# Altium schematic sheet LiPol_module.SchDoc
size A4
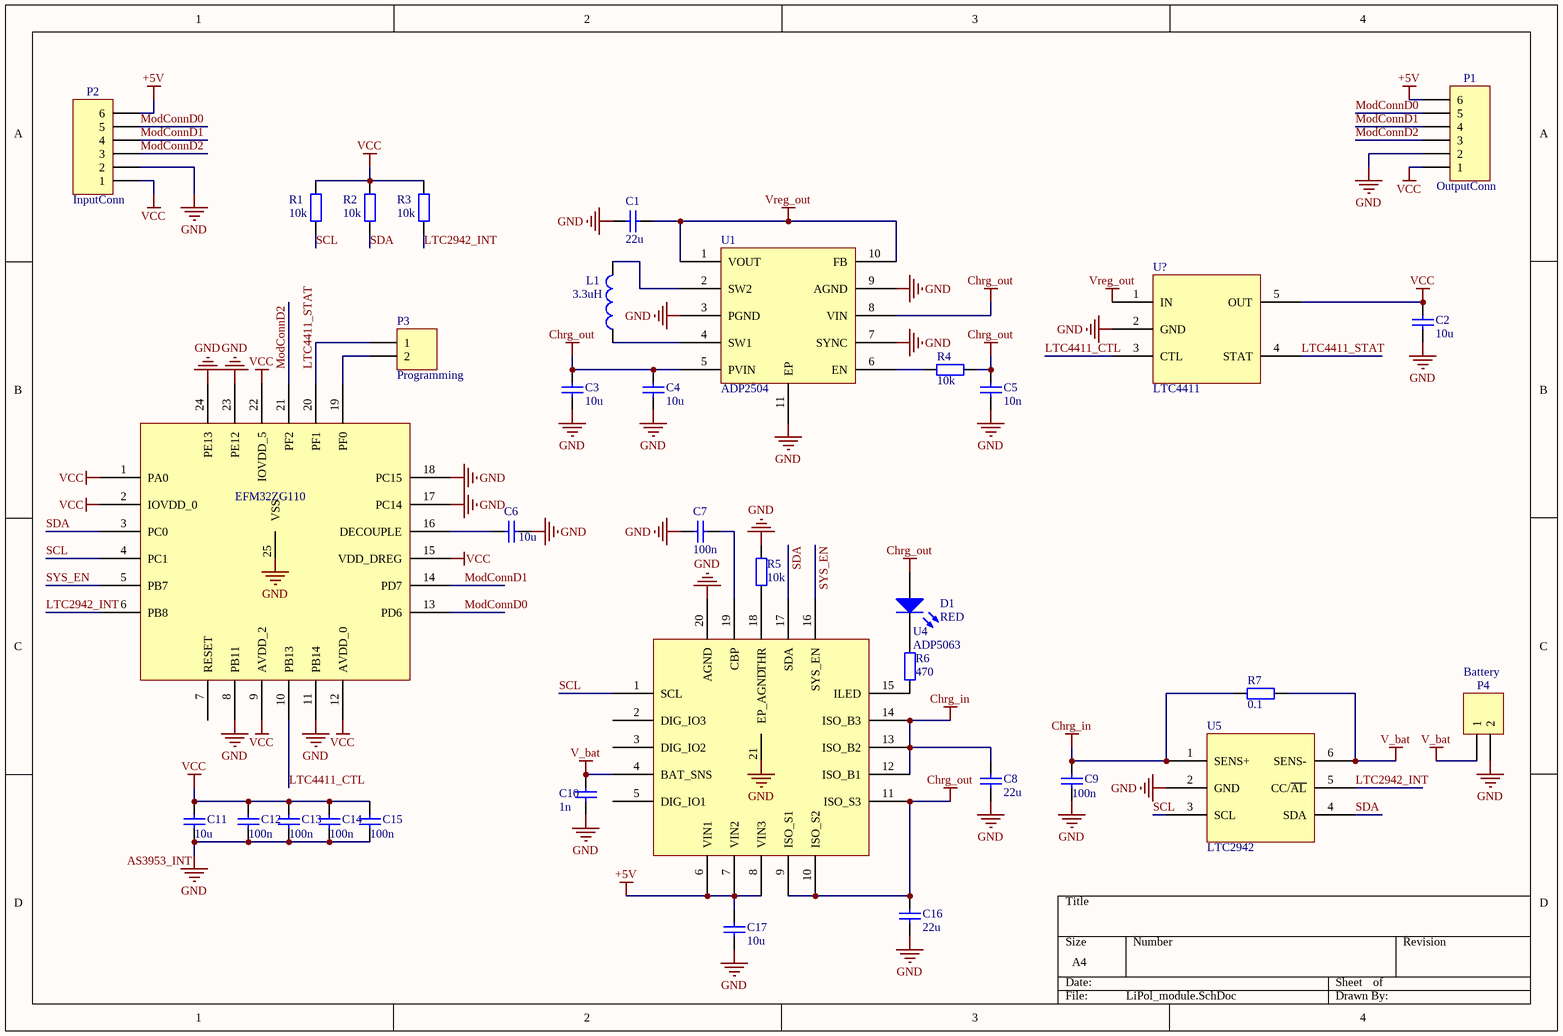
[diagram p0: LiPol_module.SchDoc]

## Parts
C1  value 22u  [C1206]  (hidden comment: 10u)
C2  10u  [0805]
C3  10u  [0805]
C4  10u  [0805]
C5  value 10n  [0402]  (hidden comment: Cap Semi)
C6  10u  [0805]
C7  value 100n  [0402]  (hidden comment: Cap Semi)
C8  value 22u  [C1206]  (hidden comment: 10u)
C9  value 100n  [0402]  (hidden comment: Cap Semi)
C10  value 1n  [0402]  (hidden comment: Cap Semi)
C11  10u  [0805]
C12  value 100n  [0402]  (hidden comment: Cap Semi)
C13  value 100n  [0402]  (hidden comment: Cap Semi)
C14  value 100n  [0402]  (hidden comment: Cap Semi)
C15  value 100n  [0402]  (hidden comment: Cap Semi)
C16  value 22u  [C1206]  (hidden comment: 10u)
C17  10u  [0805]
D1  RED  [0603]
L1  value 3.3uH  [Coil_EPL2010]  (hidden comment: EPL2010-332ML)
P1  OutputConn  [Goldpin6_1.27mm]
P2  InputConn  [Goldpin6_1.27mm]
P3  Programming  [GeckoProgramming]
P4  Battery  [Battery_Connector]
R1  value 10k  [0402]  (hidden comment: Res2)
R2  value 10k  [0402]  (hidden comment: Res2)
R3  value 10k  [0402]  (hidden comment: Res2)
R4  value 10k  [0402]  (hidden comment: Res2)
R5  value 10k  [0402]  (hidden comment: Res2)
R6  value 470  [0402]  (hidden comment: Res2)
R7  value 0.1  [0805]  (hidden comment: Res2)
U1  ADP2504  [DFN10_3x3x0.5]
U3  EFM32ZG110  [QFN24_5x5_0.65]
U4  ADP5063  [QFN20_4x4x0.5]
U5  LTC2942  [DCB 6-Lead 2x3mm]
U?  LTC4411  [SOT23-5]

## Nets
+5V: C17.2 P1.6 P2.6 U4.6(VIN1) U4.7(VIN2) U4.8(VIN3)
Chrg_in: C8.2 C9.2 R7.2 U4.12(ISO_B1) U4.13(ISO_B2) U4.14(ISO_B3) U5.1(SENS+)
Chrg_out: C3.2 C4.2 C5.2 C16.2 D1.1(A) R4.2 U1.5(PVIN) U1.8(VIN) U4.9(ISO_S1) U4.10(ISO_S2) U4.11(ISO_S3)
GND: C1.1 C2.2 C3.1 C4.1 C5.1 C6.1 C7.1 C8.1 C9.1 C10.1 C11.1 C12.1 C13.1 C14.1 C15.1 C16.1 C17.1 P1.2 P2.2 P4.2 R5.1 U1.3(PGND) U1.7(SYNC) U1.9(AGND) U1.11(EP) U3.8(PB11) U3.11(PB14) U3.17(PC14) U3.18(PC15) U3.23(PE12) U3.24(PE13) U3.25(VSS) U4.20(AGND) U4.21(EP_AGND) U5.2(GND) U?.2(GND)
V_bat: C10.2 P4.1 R7.1 U4.4(BAT_SNS) U5.6(SENS-)
VCC: C2.1 C11.2 C12.2 C13.2 C14.2 C15.2 P1.1 P2.1 R1.2 R2.2 R3.2 U3.1(PA0) U3.2(IOVDD_0) U3.9(AVDD_2) U3.12(AVDD_0) U3.15(VDD_DREG) U3.22(IOVDD_5) U?.5(OUT)
Vreg_out: C1.2 U1.1(VOUT) U1.10(FB) U?.1(IN)
LTC2942_INT: R3.1 U3.6(PB8) U5.5(CC/~{AL})
LTC4411_CTL: U3.10(PB13) U?.3(CTL)
LTC4411_STAT: P3.1 U3.20(PF1) U?.4(STAT)
ModConnD0: P1.5 P2.5 U3.13(PD6)
ModConnD1: P1.4 P2.4 U3.14(PD7)
ModConnD2: P1.3 P2.3 U3.21(PF2)
SCL: R1.1 U3.4(PC1) U4.1(SCL) U5.3(SCL)
SDA: R2.1 U3.3(PC0) U4.17(SDA) U5.4(SDA)
SYS_EN: U3.5(PB7) U4.16(SYS_EN)
NetC6_2: C6.2 U3.16(DECOUPLE)
NetC7_2: C7.2 U4.19(CBP)
NetD1_2: D1.2(K) R6.1
NetL1_1: L1.1 U1.4(SW1)
NetL1_2: L1.2 U1.2(SW2)
NetP3_2: P3.2 U3.19(PF0)
NetR4_1: R4.1 U1.6(EN)
NetR5_2: R5.2 U4.18(THR)
NetR6_2: R6.2 U4.15(ILED)

Not connected (* = marked no-connect by the designer): U3 7(RESET); U4 2(DIG_IO3) 3(DIG_IO2) 5(DIG_IO1)

## Notes on the sheet
- Labels drawn without touching a wire or pin: AS3953_INT

## Library data of the parts
C1-C17 = Cap Semi: Capacitor (Semiconductor SIM Model); Published: 8-Jun-2000; LatestRevisionDate: 29-May-2009; LatestRevisionNote: IPC-7351 Footprint Added.; PackageReference: C1206; Publisher: Altium Limited; PackageDescription: Chip Capacitor
  C2-C4 C6 C11 C17: Value: 10u
D1 = LED0: Typical INFRARED GaAs LED; Published: 8-Jun-2000; LatestRevisionDate: 08-Jul-2005; LatestRevisionNote: Mech Layer 1 removed.; PackageReference: LED-0; Publisher: Altium Limited; PackageDescription: LED; 2 Leads
L1 = Inductor: Code_IEC: 1005; Published: 8-Jun-2000; LatestRevisionDate: 29-May-2009; LatestRevisionNote: IPC-7351 Footprint Added.; PackageReference: 0402-A; Publisher: Altium Limited; PackageDescription: Chip Inductor; Code_JEITA: 0402
P1 P2 = MHDR1X6: Header, 6-Pin; LatestRevisionDate: 17-Jul-2002; LatestRevisionNote: Re-released for DXP Platform.; Publisher: Altium Limited
P3 P4 = MHDR1X2: Header, 2-Pin; LatestRevisionDate: 17-Jul-2002; LatestRevisionNote: Re-released for DXP Platform.; Publisher: Altium Limited
R1-R7 = Res2: Resistor; Published: 8-Jun-2000; LatestRevisionDate: 17-Jul-2002; LatestRevisionNote: Re-released for DXP Platform.; PackageReference: AXIAL-0.4; Publisher: Altium Limited; PackageDescription: Axial Device, Thru-Hole; 2 Leads; 0.4 in Pin Spacing